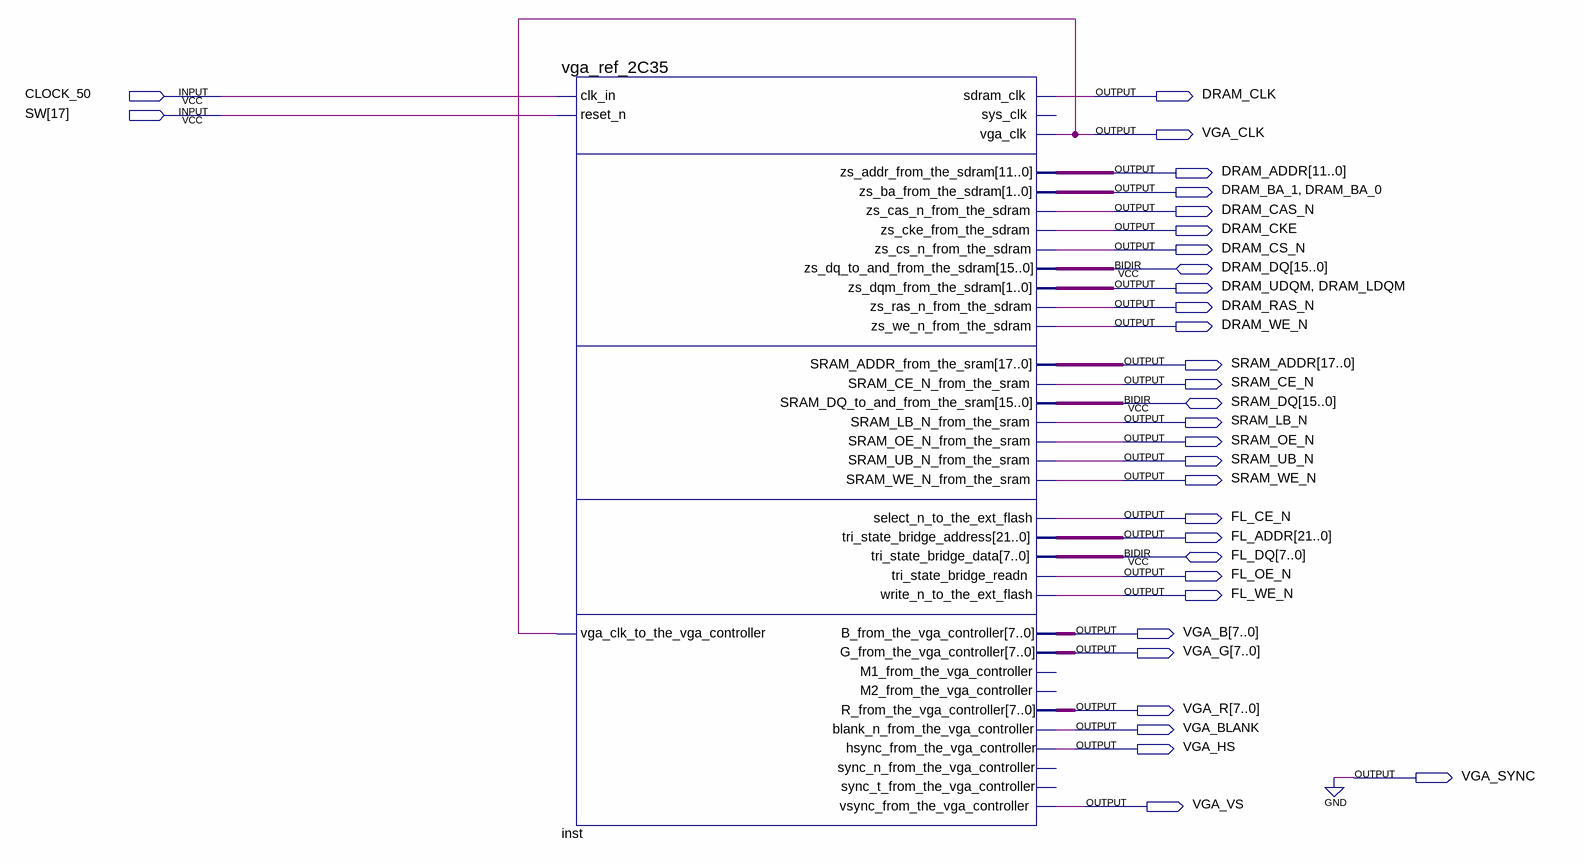
[diagram p0: schematic sheet]
// Quartus schematic vga_ref.bdf as structural Verilog: 1 symbols, 32 pins
module vga_ref (
  input  CLOCK_50,
  input  [17:17] SW,
  inout  [15:0] DRAM_DQ,
  inout  [15:0] SRAM_DQ,
  inout  [7:0] FL_DQ,
  output DRAM_CLK,
  output VGA_CLK,
  output [11:0] DRAM_ADDR,
  output DRAM_BA_1,
  output DRAM_BA_0,
  output DRAM_CAS_N,
  output DRAM_CKE,
  output DRAM_CS_N,
  output DRAM_UDQM,
  output DRAM_LDQM,
  output DRAM_RAS_N,
  output DRAM_WE_N,
  output [17:0] SRAM_ADDR,
  output SRAM_CE_N,
  output SRAM_LB_N,
  output SRAM_OE_N,
  output SRAM_UB_N,
  output SRAM_WE_N,
  output FL_CE_N,
  output [21:0] FL_ADDR,
  output FL_OE_N,
  output FL_WE_N,
  output [7:0] VGA_B,
  output [7:0] VGA_G,
  output [7:0] VGA_R,
  output VGA_BLANK,
  output VGA_HS,
  output VGA_SYNC,
  output VGA_VS
);

  vga_ref_2C35 inst (
    .clk_in(CLOCK_50), .reset_n(SW[17]), .vga_clk_to_the_vga_controller(VGA_CLK), .sdram_clk(DRAM_CLK),
    .vga_clk(VGA_CLK), .zs_addr_from_the_sdram(DRAM_ADDR), .zs_ba_from_the_sdram({DRAM_BA_1, DRAM_BA_0}),
    .zs_cas_n_from_the_sdram(DRAM_CAS_N), .zs_cke_from_the_sdram(DRAM_CKE),
    .zs_cs_n_from_the_sdram(DRAM_CS_N), .zs_dqm_from_the_sdram({DRAM_UDQM, DRAM_LDQM}),
    .zs_ras_n_from_the_sdram(DRAM_RAS_N), .zs_we_n_from_the_sdram(DRAM_WE_N),
    .SRAM_ADDR_from_the_sram(SRAM_ADDR), .SRAM_CE_N_from_the_sram(SRAM_CE_N),
    .SRAM_LB_N_from_the_sram(SRAM_LB_N), .SRAM_OE_N_from_the_sram(SRAM_OE_N),
    .SRAM_UB_N_from_the_sram(SRAM_UB_N), .SRAM_WE_N_from_the_sram(SRAM_WE_N),
    .select_n_to_the_ext_flash(FL_CE_N), .tri_state_bridge_address(FL_ADDR),
    .tri_state_bridge_readn(FL_OE_N), .write_n_to_the_ext_flash(FL_WE_N), .B_from_the_vga_controller(VGA_B),
    .G_from_the_vga_controller(VGA_G), .R_from_the_vga_controller(VGA_R),
    .blank_n_from_the_vga_controller(VGA_BLANK), .hsync_from_the_vga_controller(VGA_HS),
    .vsync_from_the_vga_controller(VGA_VS), .zs_dq_to_and_from_the_sdram(DRAM_DQ),
    .SRAM_DQ_to_and_from_the_sram(SRAM_DQ), .tri_state_bridge_data(FL_DQ));  // open: sys_clk, M1_from_the_vga_controller, M2_from_the_vga_controller, sync_n_from_the_vga_controller, sync_t_from_the_vga_controller

  assign VGA_SYNC = 1'b0;
endmodule
